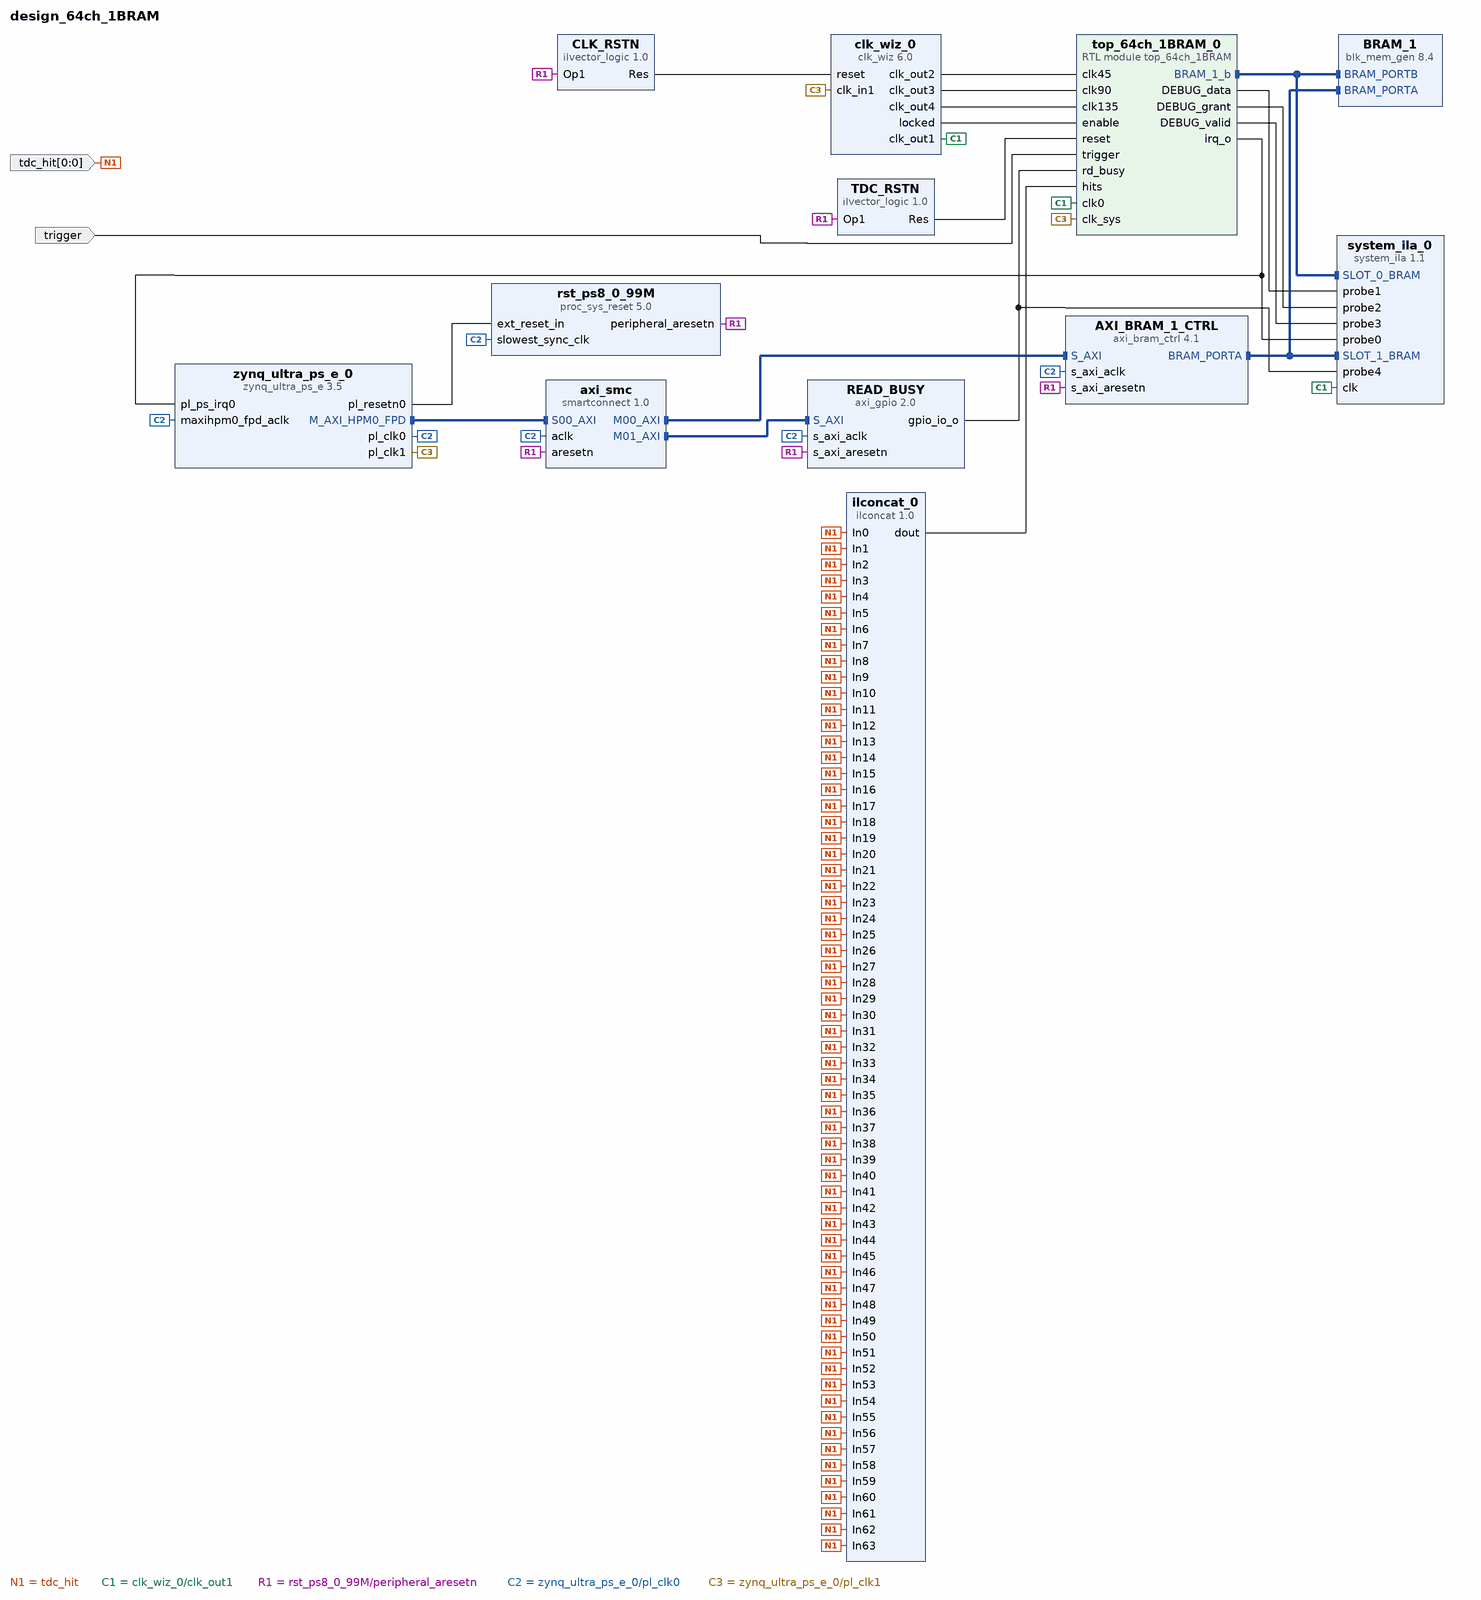
[diagram p0: block diagram of the top level]
# Vivado block design design_64ch_1BRAM, xck26-sfvc784-2LV-c, Vivado 2024.2
create_bd_design design_64ch_1BRAM

create_bd_port -dir I trigger
create_bd_port -dir I -from 0 -to 0 tdc_hit

create_bd_cell -type ip -vlnv xilinx.com:ip:zynq_ultra_ps_e:3.5 zynq_ultra_ps_e_0
set_property -dict [list \
  CONFIG.PSU_BANK_0_IO_STANDARD LVCMOS18 \
  CONFIG.PSU_BANK_1_IO_STANDARD LVCMOS18 \
  CONFIG.PSU_BANK_2_IO_STANDARD LVCMOS18 \
  CONFIG.PSU_BANK_3_IO_STANDARD LVCMOS18 \
  CONFIG.PSU_USB3__DUAL_CLOCK_ENABLE 1 \
  CONFIG.PSU__CRF_APB__ACPU_CTRL__FREQMHZ 1333.333 \
  CONFIG.PSU__CRF_APB__ACPU_CTRL__SRCSEL APLL \
  CONFIG.PSU__CRF_APB__APLL_CTRL__SRCSEL PSS_REF_CLK \
  CONFIG.PSU__CRF_APB__APLL_FRAC_CFG__ENABLED 1 \
  CONFIG.PSU__CRF_APB__DBG_FPD_CTRL__FREQMHZ 250 \
  CONFIG.PSU__CRF_APB__DBG_FPD_CTRL__SRCSEL IOPLL \
  CONFIG.PSU__CRF_APB__DBG_TRACE_CTRL__FREQMHZ 250 \
  CONFIG.PSU__CRF_APB__DBG_TRACE_CTRL__SRCSEL IOPLL \
  CONFIG.PSU__CRF_APB__DBG_TSTMP_CTRL__FREQMHZ 250 \
  CONFIG.PSU__CRF_APB__DBG_TSTMP_CTRL__SRCSEL IOPLL \
  CONFIG.PSU__CRF_APB__DDR_CTRL__FREQMHZ 1200 \
  CONFIG.PSU__CRF_APB__DDR_CTRL__SRCSEL DPLL \
  CONFIG.PSU__CRF_APB__DPDMA_REF_CTRL__FREQMHZ 600 \
  CONFIG.PSU__CRF_APB__DPDMA_REF_CTRL__SRCSEL APLL \
  CONFIG.PSU__CRF_APB__DPLL_CTRL__SRCSEL PSS_REF_CLK \
  CONFIG.PSU__CRF_APB__DP_AUDIO_REF_CTRL__SRCSEL RPLL \
  CONFIG.PSU__CRF_APB__DP_STC_REF_CTRL__SRCSEL RPLL \
  CONFIG.PSU__CRF_APB__DP_VIDEO_REF_CTRL__SRCSEL VPLL \
  CONFIG.PSU__CRF_APB__GDMA_REF_CTRL__FREQMHZ 600 \
  CONFIG.PSU__CRF_APB__GDMA_REF_CTRL__SRCSEL DPLL \
  CONFIG.PSU__CRF_APB__GPU_REF_CTRL__FREQMHZ 600 \
  CONFIG.PSU__CRF_APB__GPU_REF_CTRL__SRCSEL IOPLL \
  CONFIG.PSU__CRF_APB__TOPSW_LSBUS_CTRL__FREQMHZ 100 \
  CONFIG.PSU__CRF_APB__TOPSW_LSBUS_CTRL__SRCSEL IOPLL \
  CONFIG.PSU__CRF_APB__TOPSW_MAIN_CTRL__FREQMHZ 533.33 \
  CONFIG.PSU__CRF_APB__TOPSW_MAIN_CTRL__SRCSEL DPLL \
  CONFIG.PSU__CRF_APB__VPLL_CTRL__SRCSEL PSS_REF_CLK \
  CONFIG.PSU__CRL_APB__ADMA_REF_CTRL__FREQMHZ 500 \
  CONFIG.PSU__CRL_APB__ADMA_REF_CTRL__SRCSEL IOPLL \
  CONFIG.PSU__CRL_APB__CPU_R5_CTRL__FREQMHZ 533.333 \
  CONFIG.PSU__CRL_APB__CPU_R5_CTRL__SRCSEL RPLL \
  CONFIG.PSU__CRL_APB__DBG_LPD_CTRL__FREQMHZ 250 \
  CONFIG.PSU__CRL_APB__DBG_LPD_CTRL__SRCSEL IOPLL \
  CONFIG.PSU__CRL_APB__I2C1_REF_CTRL__FREQMHZ 100 \
  CONFIG.PSU__CRL_APB__I2C1_REF_CTRL__SRCSEL IOPLL \
  CONFIG.PSU__CRL_APB__IOPLL_CTRL__SRCSEL PSS_REF_CLK \
  CONFIG.PSU__CRL_APB__IOU_SWITCH_CTRL__FREQMHZ 250 \
  CONFIG.PSU__CRL_APB__IOU_SWITCH_CTRL__SRCSEL IOPLL \
  CONFIG.PSU__CRL_APB__LPD_LSBUS_CTRL__FREQMHZ 100 \
  CONFIG.PSU__CRL_APB__LPD_LSBUS_CTRL__SRCSEL IOPLL \
  CONFIG.PSU__CRL_APB__LPD_SWITCH_CTRL__FREQMHZ 500 \
  CONFIG.PSU__CRL_APB__LPD_SWITCH_CTRL__SRCSEL IOPLL \
  CONFIG.PSU__CRL_APB__PCAP_CTRL__FREQMHZ 200 \
  CONFIG.PSU__CRL_APB__PCAP_CTRL__SRCSEL IOPLL \
  CONFIG.PSU__CRL_APB__PL0_REF_CTRL__FREQMHZ 100 \
  CONFIG.PSU__CRL_APB__PL0_REF_CTRL__SRCSEL IOPLL \
  CONFIG.PSU__CRL_APB__PL1_REF_CTRL__FREQMHZ 50 \
  CONFIG.PSU__CRL_APB__PL1_REF_CTRL__SRCSEL IOPLL \
  CONFIG.PSU__CRL_APB__QSPI_REF_CTRL__FREQMHZ 125 \
  CONFIG.PSU__CRL_APB__QSPI_REF_CTRL__SRCSEL IOPLL \
  CONFIG.PSU__CRL_APB__RPLL_CTRL__SRCSEL PSS_REF_CLK \
  CONFIG.PSU__CRL_APB__SPI1_REF_CTRL__SRCSEL IOPLL \
  CONFIG.PSU__CRL_APB__TIMESTAMP_REF_CTRL__FREQMHZ 100 \
  CONFIG.PSU__CRL_APB__TIMESTAMP_REF_CTRL__SRCSEL IOPLL \
  CONFIG.PSU__CRL_APB__UART1_REF_CTRL__FREQMHZ 100 \
  CONFIG.PSU__CRL_APB__UART1_REF_CTRL__SRCSEL IOPLL \
  CONFIG.PSU__CRL_APB__USB0_BUS_REF_CTRL__FREQMHZ 250 \
  CONFIG.PSU__CRL_APB__USB0_BUS_REF_CTRL__SRCSEL IOPLL \
  CONFIG.PSU__CRL_APB__USB3_DUAL_REF_CTRL__FREQMHZ 20 \
  CONFIG.PSU__CRL_APB__USB3_DUAL_REF_CTRL__SRCSEL IOPLL \
  CONFIG.PSU__CRL_APB__USB3__ENABLE 1 \
  CONFIG.PSU__CSUPMU__PERIPHERAL__VALID 1 \
  CONFIG.PSU__DDRC__BUS_WIDTH {64 Bit} \
  CONFIG.PSU__DDRC__COMPONENTS Components \
  CONFIG.PSU__DDRC__DEVICE_CAPACITY {8192 MBits} \
  CONFIG.PSU__DDRC__DRAM_WIDTH {16 Bits} \
  CONFIG.PSU__DDRC__ECC Disabled \
  CONFIG.PSU__DDRC__MEMORY_TYPE {DDR 4} \
  CONFIG.PSU__DDRC__SPEED_BIN DDR4_2400R \
  CONFIG.PSU__DDR_HIGH_ADDRESS_GUI_ENABLE 1 \
  CONFIG.PSU__DDR__INTERFACE__FREQMHZ 600.000 \
  CONFIG.PSU__DISPLAYPORT__PERIPHERAL__ENABLE 0 \
  CONFIG.PSU__FPGA_PL0_ENABLE 1 \
  CONFIG.PSU__FPGA_PL1_ENABLE 1 \
  CONFIG.PSU__GPIO0_MIO__IO {MIO 0 .. 25} \
  CONFIG.PSU__GPIO0_MIO__PERIPHERAL__ENABLE 1 \
  CONFIG.PSU__GPIO1_MIO__IO {MIO 26 .. 51} \
  CONFIG.PSU__GPIO1_MIO__PERIPHERAL__ENABLE 1 \
  CONFIG.PSU__I2C1__PERIPHERAL__ENABLE 1 \
  CONFIG.PSU__I2C1__PERIPHERAL__IO {MIO 24 .. 25} \
  CONFIG.PSU__IOU_SLCR__IOU_TTC_APB_CLK__TTC0_SEL APB \
  CONFIG.PSU__IOU_SLCR__IOU_TTC_APB_CLK__TTC1_SEL APB \
  CONFIG.PSU__IOU_SLCR__IOU_TTC_APB_CLK__TTC2_SEL APB \
  CONFIG.PSU__IOU_SLCR__IOU_TTC_APB_CLK__TTC3_SEL APB \
  CONFIG.PSU__MAXIGP0__DATA_WIDTH 128 \
  CONFIG.PSU__OVERRIDE__BASIC_CLOCK 0 \
  CONFIG.PSU__PMU_COHERENCY 0 \
  CONFIG.PSU__PMU__AIBACK__ENABLE 0 \
  CONFIG.PSU__PMU__EMIO_GPI__ENABLE 0 \
  CONFIG.PSU__PMU__EMIO_GPO__ENABLE 0 \
  CONFIG.PSU__PMU__GPI0__ENABLE 1 \
  CONFIG.PSU__PMU__GPI0__IO {MIO 26} \
  CONFIG.PSU__PMU__GPI1__ENABLE 0 \
  CONFIG.PSU__PMU__GPI2__ENABLE 0 \
  CONFIG.PSU__PMU__GPI3__ENABLE 0 \
  CONFIG.PSU__PMU__GPI4__ENABLE 0 \
  CONFIG.PSU__PMU__GPI5__ENABLE 1 \
  CONFIG.PSU__PMU__GPI5__IO {MIO 31} \
  CONFIG.PSU__PMU__GPO0__ENABLE 0 \
  CONFIG.PSU__PMU__GPO1__ENABLE 0 \
  CONFIG.PSU__PMU__GPO2__ENABLE 0 \
  CONFIG.PSU__PMU__GPO3__ENABLE 1 \
  CONFIG.PSU__PMU__GPO3__IO {MIO 35} \
  CONFIG.PSU__PMU__GPO3__POLARITY low \
  CONFIG.PSU__PMU__GPO4__ENABLE 0 \
  CONFIG.PSU__PMU__GPO5__ENABLE 0 \
  CONFIG.PSU__PMU__PERIPHERAL__ENABLE 1 \
  CONFIG.PSU__PMU__PLERROR__ENABLE 0 \
  CONFIG.PSU__PRESET_APPLIED 1 \
  CONFIG.PSU__PSS_REF_CLK__FREQMHZ 33.333 \
  CONFIG.PSU__QSPI_COHERENCY 0 \
  CONFIG.PSU__QSPI_ROUTE_THROUGH_FPD 0 \
  CONFIG.PSU__QSPI__GRP_FBCLK__ENABLE 0 \
  CONFIG.PSU__QSPI__PERIPHERAL__DATA_MODE x4 \
  CONFIG.PSU__QSPI__PERIPHERAL__ENABLE 1 \
  CONFIG.PSU__QSPI__PERIPHERAL__IO {MIO 0 .. 5} \
  CONFIG.PSU__QSPI__PERIPHERAL__MODE Single \
  CONFIG.PSU__SPI1__GRP_SS0__IO {MIO 9} \
  CONFIG.PSU__SPI1__PERIPHERAL__ENABLE 1 \
  CONFIG.PSU__SPI1__PERIPHERAL__IO {MIO 6 .. 11} \
  CONFIG.PSU__SWDT0__CLOCK__ENABLE 0 \
  CONFIG.PSU__SWDT0__PERIPHERAL__ENABLE 1 \
  CONFIG.PSU__SWDT0__RESET__ENABLE 0 \
  CONFIG.PSU__SWDT1__CLOCK__ENABLE 0 \
  CONFIG.PSU__SWDT1__PERIPHERAL__ENABLE 1 \
  CONFIG.PSU__SWDT1__RESET__ENABLE 0 \
  CONFIG.PSU__TTC0__CLOCK__ENABLE 0 \
  CONFIG.PSU__TTC0__PERIPHERAL__ENABLE 1 \
  CONFIG.PSU__TTC0__WAVEOUT__ENABLE 0 \
  CONFIG.PSU__TTC1__CLOCK__ENABLE 0 \
  CONFIG.PSU__TTC1__PERIPHERAL__ENABLE 1 \
  CONFIG.PSU__TTC1__WAVEOUT__ENABLE 0 \
  CONFIG.PSU__TTC2__CLOCK__ENABLE 0 \
  CONFIG.PSU__TTC2__PERIPHERAL__ENABLE 1 \
  CONFIG.PSU__TTC2__WAVEOUT__ENABLE 0 \
  CONFIG.PSU__TTC3__CLOCK__ENABLE 0 \
  CONFIG.PSU__TTC3__PERIPHERAL__ENABLE 1 \
  CONFIG.PSU__TTC3__WAVEOUT__ENABLE 0 \
  CONFIG.PSU__UART1__BAUD_RATE 115200 \
  CONFIG.PSU__UART1__MODEM__ENABLE 0 \
  CONFIG.PSU__UART1__PERIPHERAL__ENABLE 1 \
  CONFIG.PSU__UART1__PERIPHERAL__IO {MIO 36 .. 37} \
  CONFIG.PSU__USB0_COHERENCY 0 \
  CONFIG.PSU__USB0__PERIPHERAL__ENABLE 1 \
  CONFIG.PSU__USB0__PERIPHERAL__IO {MIO 52 .. 63} \
  CONFIG.PSU__USB0__REF_CLK_FREQ 26 \
  CONFIG.PSU__USB0__REF_CLK_SEL {Ref Clk2} \
  CONFIG.PSU__USB0__RESET__ENABLE 1 \
  CONFIG.PSU__USB0__RESET__IO {MIO 76} \
  CONFIG.PSU__USB1__PERIPHERAL__ENABLE 1 \
  CONFIG.PSU__USB1__PERIPHERAL__IO {MIO 64 .. 75} \
  CONFIG.PSU__USB1__REF_CLK_FREQ 26 \
  CONFIG.PSU__USB1__REF_CLK_SEL {Ref Clk3} \
  CONFIG.PSU__USB1__RESET__ENABLE 1 \
  CONFIG.PSU__USB1__RESET__IO {MIO 77} \
  CONFIG.PSU__USB2_0__EMIO__ENABLE 0 \
  CONFIG.PSU__USB3_0__EMIO__ENABLE 0 \
  CONFIG.PSU__USB3_0__PERIPHERAL__ENABLE 1 \
  CONFIG.PSU__USB3_0__PERIPHERAL__IO {GT Lane2} \
  CONFIG.PSU__USB3_1__PERIPHERAL__ENABLE 1 \
  CONFIG.PSU__USB3_1__PERIPHERAL__IO {GT Lane3} \
  CONFIG.PSU__USB__RESET__MODE {Separate MIO Pin} \
  CONFIG.PSU__USB__RESET__POLARITY {Active Low} \
  CONFIG.PSU__USE__IRQ0 1 \
  CONFIG.PSU__USE__M_AXI_GP0 1 \
  CONFIG.PSU__USE__M_AXI_GP1 0 \
  CONFIG.PSU__USE__M_AXI_GP2 0 \
] [get_bd_cells zynq_ultra_ps_e_0]
# 261 more settings of zynq_ultra_ps_e_0 are not shown: defaults, MIO pin electricals, DDR timing, and values the tool derives
create_bd_cell -type ip -vlnv xilinx.com:ip:axi_bram_ctrl:4.1 AXI_BRAM_1_CTRL
set_property -dict {CONFIG.DATA_WIDTH 64 CONFIG.SINGLE_PORT_BRAM 1} [get_bd_cells AXI_BRAM_1_CTRL]
create_bd_cell -type ip -vlnv xilinx.com:ip:blk_mem_gen:8.4 BRAM_1
set_property -dict {CONFIG.Memory_Type True_Dual_Port_RAM} [get_bd_cells BRAM_1]
create_bd_cell -type ip -vlnv xilinx.com:ip:smartconnect:1.0 axi_smc
set_property -dict {CONFIG.NUM_MI 2 CONFIG.NUM_SI 1} [get_bd_cells axi_smc]
create_bd_cell -type ip -vlnv xilinx.com:ip:proc_sys_reset:5.0 rst_ps8_0_99M
create_bd_cell -type module -reference top_64ch_1BRAM top_64ch_1BRAM_0
create_bd_cell -type ip -vlnv xilinx.com:ip:clk_wiz:6.0 clk_wiz_0
set_property -dict [list \
  CONFIG.CLKIN1_JITTER_PS 200.0 \
  CONFIG.CLKOUT1_JITTER 109.401 \
  CONFIG.CLKOUT1_PHASE_ERROR 138.125 \
  CONFIG.CLKOUT1_REQUESTED_OUT_FREQ 199.998 \
  CONFIG.CLKOUT1_REQUESTED_PHASE 0 \
  CONFIG.CLKOUT2_JITTER 109.401 \
  CONFIG.CLKOUT2_PHASE_ERROR 138.125 \
  CONFIG.CLKOUT2_REQUESTED_OUT_FREQ 199.998 \
  CONFIG.CLKOUT2_REQUESTED_PHASE 45 \
  CONFIG.CLKOUT2_USED true \
  CONFIG.CLKOUT3_JITTER 109.401 \
  CONFIG.CLKOUT3_PHASE_ERROR 138.125 \
  CONFIG.CLKOUT3_REQUESTED_OUT_FREQ 199.998 \
  CONFIG.CLKOUT3_REQUESTED_PHASE 90 \
  CONFIG.CLKOUT3_USED true \
  CONFIG.CLKOUT4_JITTER 109.401 \
  CONFIG.CLKOUT4_PHASE_ERROR 138.125 \
  CONFIG.CLKOUT4_REQUESTED_OUT_FREQ 199.998 \
  CONFIG.CLKOUT4_REQUESTED_PHASE 135 \
  CONFIG.CLKOUT4_USED true \
  CONFIG.MMCM_CLKFBOUT_MULT_F 28.000 \
  CONFIG.MMCM_CLKIN1_PERIOD 20.000 \
  CONFIG.MMCM_CLKIN2_PERIOD 10.0 \
  CONFIG.MMCM_CLKOUT0_DIVIDE_F 7.000 \
  CONFIG.MMCM_CLKOUT1_DIVIDE 7 \
  CONFIG.MMCM_CLKOUT1_PHASE 45.000 \
  CONFIG.MMCM_CLKOUT2_DIVIDE 7 \
  CONFIG.MMCM_CLKOUT2_PHASE 90.000 \
  CONFIG.MMCM_CLKOUT3_DIVIDE 7 \
  CONFIG.MMCM_CLKOUT3_PHASE 135.000 \
  CONFIG.NUM_OUT_CLKS 4 \
  CONFIG.PRIM_IN_FREQ 49.9995 \
] [get_bd_cells clk_wiz_0]
create_bd_cell -type inline_hdl -vlnv xilinx.com:inline_hdl:ilvector_logic:1.0 TDC_RSTN
set_property -dict {CONFIG.C_OPERATION not CONFIG.C_SIZE 1} [get_bd_cells TDC_RSTN]
create_bd_cell -type inline_hdl -vlnv xilinx.com:inline_hdl:ilvector_logic:1.0 CLK_RSTN
set_property -dict {CONFIG.C_OPERATION not CONFIG.C_SIZE 1} [get_bd_cells CLK_RSTN]
create_bd_cell -type ip -vlnv xilinx.com:ip:axi_gpio:2.0 READ_BUSY
set_property -dict {CONFIG.C_ALL_OUTPUTS 1 CONFIG.C_GPIO_WIDTH 1} [get_bd_cells READ_BUSY]
create_bd_cell -type inline_hdl -vlnv xilinx.com:inline_hdl:ilconcat:1.0 ilconcat_0
set_property -dict {CONFIG.NUM_PORTS 64} [get_bd_cells ilconcat_0]
create_bd_cell -type ip -vlnv xilinx.com:ip:system_ila:1.1 system_ila_0
set_property -dict [list \
  CONFIG.C_MON_TYPE MIX \
  CONFIG.C_NUM_MONITOR_SLOTS 2 \
  CONFIG.C_NUM_OF_PROBES 5 \
  CONFIG.C_PROBE0_TYPE 0 \
  CONFIG.C_PROBE1_TYPE 0 \
  CONFIG.C_PROBE2_TYPE 0 \
  CONFIG.C_PROBE3_TYPE 0 \
  CONFIG.C_PROBE4_TYPE 0 \
  CONFIG.C_SLOT_0_INTF_TYPE xilinx.com:interface:bram_rtl:1.0 \
  CONFIG.C_SLOT_0_TYPE 0 \
  CONFIG.C_SLOT_1_INTF_TYPE xilinx.com:interface:bram_rtl:1.0 \
  CONFIG.C_SLOT_1_TYPE 0 \
] [get_bd_cells system_ila_0]

# ---- connections ----

connect_bd_intf_net -intf_net AXI_BRAM_1_CTRL_BRAM_PORTA [get_bd_intf_pins AXI_BRAM_1_CTRL/BRAM_PORTA] [get_bd_intf_pins BRAM_1/BRAM_PORTA]
connect_bd_intf_net [get_bd_intf_pins AXI_BRAM_1_CTRL/BRAM_PORTA] [get_bd_intf_pins system_ila_0/SLOT_1_BRAM]
connect_bd_intf_net [get_bd_intf_pins axi_smc/M00_AXI] [get_bd_intf_pins AXI_BRAM_1_CTRL/S_AXI]
connect_bd_intf_net [get_bd_intf_pins axi_smc/M01_AXI] [get_bd_intf_pins READ_BUSY/S_AXI]
connect_bd_intf_net -intf_net top_64ch_1BRAM_0_BRAM_1_b [get_bd_intf_pins top_64ch_1BRAM_0/BRAM_1_b] [get_bd_intf_pins BRAM_1/BRAM_PORTB]
connect_bd_intf_net [get_bd_intf_pins top_64ch_1BRAM_0/BRAM_1_b] [get_bd_intf_pins system_ila_0/SLOT_0_BRAM]
connect_bd_intf_net [get_bd_intf_pins zynq_ultra_ps_e_0/M_AXI_HPM0_FPD] [get_bd_intf_pins axi_smc/S00_AXI]
connect_bd_net [get_bd_pins CLK_RSTN/Res] [get_bd_pins clk_wiz_0/reset]
connect_bd_net -net DEBUG_data [get_bd_pins top_64ch_1BRAM_0/DEBUG_data] [get_bd_pins system_ila_0/probe1]
connect_bd_net -net DEBUG_grant [get_bd_pins top_64ch_1BRAM_0/DEBUG_grant] [get_bd_pins system_ila_0/probe2]
connect_bd_net -net DEBUG_valid [get_bd_pins top_64ch_1BRAM_0/DEBUG_valid] [get_bd_pins system_ila_0/probe3]
connect_bd_net -net In0_0_1 [get_bd_ports tdc_hit] \
  [get_bd_pins ilconcat_0/In0] [get_bd_pins ilconcat_0/In51] [get_bd_pins ilconcat_0/In44] [get_bd_pins ilconcat_0/In25] \
  [get_bd_pins ilconcat_0/In10] [get_bd_pins ilconcat_0/In7] [get_bd_pins ilconcat_0/In50] [get_bd_pins ilconcat_0/In47] \
  [get_bd_pins ilconcat_0/In24] [get_bd_pins ilconcat_0/In21] [get_bd_pins ilconcat_0/In6] [get_bd_pins ilconcat_0/In61] \
  [get_bd_pins ilconcat_0/In46] [get_bd_pins ilconcat_0/In27] [get_bd_pins ilconcat_0/In20] [get_bd_pins ilconcat_0/In1] \
  [get_bd_pins ilconcat_0/In60] [get_bd_pins ilconcat_0/In41] [get_bd_pins ilconcat_0/In26] [get_bd_pins ilconcat_0/In23] \
  [get_bd_pins ilconcat_0/In63] [get_bd_pins ilconcat_0/In40] [get_bd_pins ilconcat_0/In37] [get_bd_pins ilconcat_0/In22] \
  [get_bd_pins ilconcat_0/In3] [get_bd_pins ilconcat_0/In62] [get_bd_pins ilconcat_0/In43] [get_bd_pins ilconcat_0/In36] \
  [get_bd_pins ilconcat_0/In17] [get_bd_pins ilconcat_0/In2] [get_bd_pins ilconcat_0/In57] [get_bd_pins ilconcat_0/In42] \
  [get_bd_pins ilconcat_0/In39] [get_bd_pins ilconcat_0/In16] [get_bd_pins ilconcat_0/In13] [get_bd_pins ilconcat_0/In56] \
  [get_bd_pins ilconcat_0/In53] [get_bd_pins ilconcat_0/In38] [get_bd_pins ilconcat_0/In19] [get_bd_pins ilconcat_0/In12] \
  [get_bd_pins ilconcat_0/In59] [get_bd_pins ilconcat_0/In52] [get_bd_pins ilconcat_0/In33] [get_bd_pins ilconcat_0/In18] \
  [get_bd_pins ilconcat_0/In15] [get_bd_pins ilconcat_0/In58] [get_bd_pins ilconcat_0/In55] [get_bd_pins ilconcat_0/In32] \
  [get_bd_pins ilconcat_0/In29] [get_bd_pins ilconcat_0/In14] [get_bd_pins ilconcat_0/In54] [get_bd_pins ilconcat_0/In35] \
  [get_bd_pins ilconcat_0/In28] [get_bd_pins ilconcat_0/In9] [get_bd_pins ilconcat_0/In49] [get_bd_pins ilconcat_0/In34] \
  [get_bd_pins ilconcat_0/In31] [get_bd_pins ilconcat_0/In8] [get_bd_pins ilconcat_0/In5] [get_bd_pins ilconcat_0/In48] \
  [get_bd_pins ilconcat_0/In45] [get_bd_pins ilconcat_0/In30] [get_bd_pins ilconcat_0/In11] [get_bd_pins ilconcat_0/In4]
connect_bd_net -net READ_BUSY_gpio_io_o [get_bd_pins READ_BUSY/gpio_io_o] [get_bd_pins top_64ch_1BRAM_0/rd_busy] [get_bd_pins system_ila_0/probe4]
connect_bd_net [get_bd_pins TDC_RSTN/Res] [get_bd_pins top_64ch_1BRAM_0/reset]
connect_bd_net [get_bd_pins clk_wiz_0/clk_out1] [get_bd_pins top_64ch_1BRAM_0/clk0] [get_bd_pins system_ila_0/clk]
connect_bd_net [get_bd_pins clk_wiz_0/clk_out2] [get_bd_pins top_64ch_1BRAM_0/clk45]
connect_bd_net [get_bd_pins clk_wiz_0/clk_out3] [get_bd_pins top_64ch_1BRAM_0/clk90]
connect_bd_net [get_bd_pins clk_wiz_0/clk_out4] [get_bd_pins top_64ch_1BRAM_0/clk135]
connect_bd_net [get_bd_pins clk_wiz_0/locked] [get_bd_pins top_64ch_1BRAM_0/enable]
connect_bd_net [get_bd_pins ilconcat_0/dout] [get_bd_pins top_64ch_1BRAM_0/hits]
connect_bd_net [get_bd_pins rst_ps8_0_99M/peripheral_aresetn] \
  [get_bd_pins AXI_BRAM_1_CTRL/s_axi_aresetn] [get_bd_pins axi_smc/aresetn] [get_bd_pins CLK_RSTN/Op1] \
  [get_bd_pins TDC_RSTN/Op1] [get_bd_pins READ_BUSY/s_axi_aresetn]
connect_bd_net -net top_64ch_1BRAM_0_irq_o [get_bd_pins top_64ch_1BRAM_0/irq_o] \
  [get_bd_pins zynq_ultra_ps_e_0/pl_ps_irq0] [get_bd_pins system_ila_0/probe0]
connect_bd_net -net trigger_0_1 [get_bd_ports trigger] [get_bd_pins top_64ch_1BRAM_0/trigger]
connect_bd_net [get_bd_pins zynq_ultra_ps_e_0/pl_clk0] \
  [get_bd_pins zynq_ultra_ps_e_0/maxihpm0_fpd_aclk] [get_bd_pins axi_smc/aclk] [get_bd_pins AXI_BRAM_1_CTRL/s_axi_aclk] \
  [get_bd_pins rst_ps8_0_99M/slowest_sync_clk] [get_bd_pins READ_BUSY/s_axi_aclk]
connect_bd_net [get_bd_pins zynq_ultra_ps_e_0/pl_clk1] [get_bd_pins clk_wiz_0/clk_in1] [get_bd_pins top_64ch_1BRAM_0/clk_sys]
connect_bd_net [get_bd_pins zynq_ultra_ps_e_0/pl_resetn0] [get_bd_pins rst_ps8_0_99M/ext_reset_in]
set_property HDL_ATTRIBUTE.DEBUG true [get_bd_intf_nets AXI_BRAM_1_CTRL_BRAM_PORTA]
set_property HDL_ATTRIBUTE.MARK_DEBUG true [get_bd_intf_nets AXI_BRAM_1_CTRL_BRAM_PORTA]
set_property HDL_ATTRIBUTE.DEBUG true [get_bd_intf_nets top_64ch_1BRAM_0_BRAM_1_b]
set_property HDL_ATTRIBUTE.MARK_DEBUG true [get_bd_intf_nets top_64ch_1BRAM_0_BRAM_1_b]
set_property HDL_ATTRIBUTE.DEBUG true [get_bd_nets DEBUG_data]
set_property HDL_ATTRIBUTE.MARK_DEBUG true [get_bd_nets DEBUG_data]
set_property HDL_ATTRIBUTE.DEBUG true [get_bd_nets DEBUG_grant]
set_property HDL_ATTRIBUTE.MARK_DEBUG true [get_bd_nets DEBUG_grant]
set_property HDL_ATTRIBUTE.DEBUG true [get_bd_nets DEBUG_valid]
set_property HDL_ATTRIBUTE.MARK_DEBUG true [get_bd_nets DEBUG_valid]
set_property HDL_ATTRIBUTE.DEBUG true [get_bd_nets READ_BUSY_gpio_io_o]
set_property HDL_ATTRIBUTE.MARK_DEBUG true [get_bd_nets READ_BUSY_gpio_io_o]
set_property HDL_ATTRIBUTE.DEBUG true [get_bd_nets top_64ch_1BRAM_0_irq_o]
set_property HDL_ATTRIBUTE.MARK_DEBUG true [get_bd_nets top_64ch_1BRAM_0_irq_o]

# ---- address map ----
assign_bd_address -offset 0x00A0000000 -range 8K -target_address_space [get_bd_addr_spaces zynq_ultra_ps_e_0/Data] [get_bd_addr_segs AXI_BRAM_1_CTRL/S_AXI/Mem0]
assign_bd_address -offset 0x00A0010000 -range 64K -target_address_space [get_bd_addr_spaces zynq_ultra_ps_e_0/Data] [get_bd_addr_segs READ_BUSY/S_AXI/Reg]

validate_bd_design
save_bd_design
